# EAGLE design Shruthi-Analog-SMR4-mkII-12V-v03 (EAGLE 5.09)
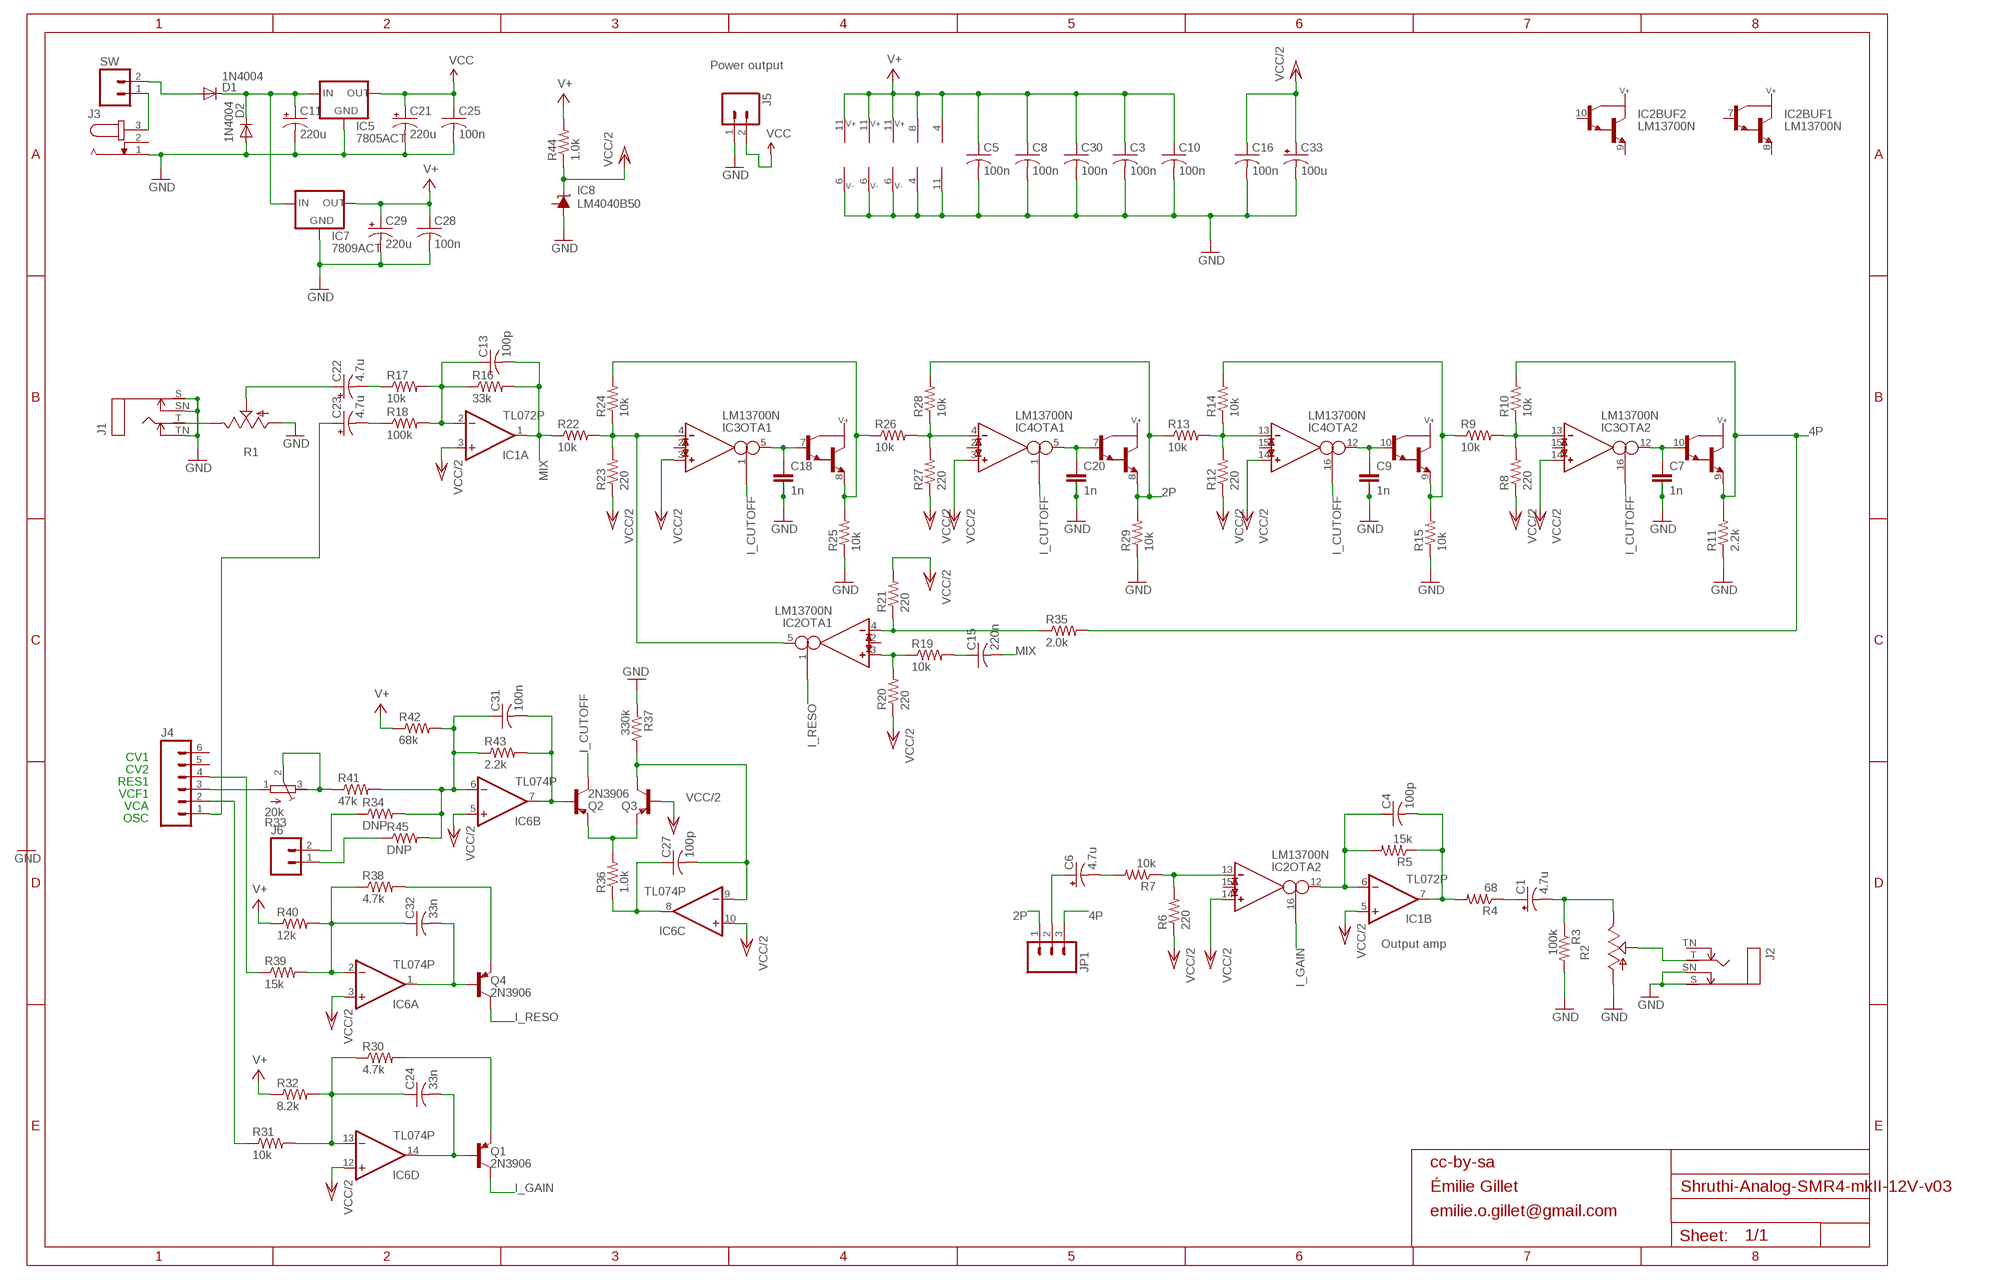
[diagram p0: schematic, sheet 1]

## Parts
C1  4.7u  CPOL-USE2.5-6  [E2,5-6]
C3  100n  C-US025-025X050  [C025-025X050]
C4  100p  C-US025-025X050  [C025-025X050]
C5  100n  C-US025-025X050  [C025-025X050]
C6  4.7u  CPOL-USE2.5-6  [E2,5-6]
C7  1n  C-2.5-5/2  [C2.5/5-2]
C8  100n  C-US025-025X050  [C025-025X050]
C9  1n  C-2.5-5/2  [C2.5/5-2]
C10  100n  C-US025-025X050  [C025-025X050]
C11  220u  CPOL-USE5-10.5  [E5-10,5]
C13  100p  C-US025-025X050  [C025-025X050]
C15  220n  C-US025-025X050  [C025-025X050]
C16  100n  C-US025-025X050  [C025-025X050]
C18  1n  C-2.5-5/2  [C2.5/5-2]
C20  1n  C-2.5-5/2  [C2.5/5-2]
C21  220u  CPOL-USE5-10.5  [E5-10,5]
C22  4.7u  CPOL-USE2.5-6  [E2,5-6]
C23  4.7u  CPOL-USE2.5-6  [E2,5-6]
C24  33n  C-US050-025X075  [C050-025X075]
C25  100n  C-US025-025X050  [C025-025X050]
C27  100p  C-US025-025X050  [C025-025X050]
C28  100n  C-US025-025X050  [C025-025X050]
C29  220u  CPOL-USE5-10.5  [E5-10,5]
C30  100n  C-US025-025X050  [C025-025X050]
C31  100n  C-US025-025X050  [C025-025X050]
C32  33n  C-US050-025X075  [C050-025X075]
C33  100u  CPOL-USE2.5-6  [E2,5-6]
D1  1N4004  [DO41-10]
D2  1N4004  [DO41-10]
IC1  TL072P  [DIL08]
IC2  LM13700N  [DIL16]
IC3  LM13700N  [DIL16]
IC4  LM13700N  [DIL16]
IC5  7805ACT  78XXS  [78XXS]
IC6  TL074P  TL084P  [DIL14]
IC7  7809ACT  78XXS  [78XXS]
IC8  LM4040B50  LM4041BILP  [LP_O-PBCY-W3]
J1  MONOSWS  [NMJ4HC-S]
J2  MONOSWS  [NMJ4HC-S]
J3  JACK-PLUG2  [SPC4078_BIG_HOLES]
J4  M06SIP  [1X06]
J5  M02PTH  [1X02]
J6  M02PTH  [1X02]
JP1  M03PTH  [1X03]
Q1  2N3906  2N3906-  [TO92-]
Q2  2N3906  2N3906-  [TO92-]
Q3  2N3906  2N3906-  [TO92-]
Q4  2N3906  2N3906-  [TO92-]
R1  POT_USCABLED  [CABLE_POT_6MM]
R2  POT_USCABLED  [CABLE_POT_6MM]
R3  100k  R-US_0204/7  [0204/7]
R4  68  R-US_0204/7  [0204/7]
R5  15k  R-US_0204/7  [0204/7]
R6  220  R-US_0204/7  [0204/7]
R7  10k  R-US_0204/7  [0204/7]
R8  220  R-US_0204/7  [0204/7]
R9  10k  R-US_0204/7  [0204/7]
R10  10k  R-US_0204/7  [0204/7]
R11  2.2k  R-US_0204/7  [0204/7]
R12  220  R-US_0204/7  [0204/7]
R13  10k  R-US_0204/7  [0204/7]
R14  10k  R-US_0204/7  [0204/7]
R15  10k  R-US_0204/7  [0204/7]
R16  33k  R-US_0204/7  [0204/7]
R17  10k  R-US_0204/7  [0204/7]
R18  100k  R-US_0204/7  [0204/7]
R19  10k  R-US_0204/7  [0204/7]
R20  220  R-US_0204/7  [0204/7]
R21  220  R-US_0204/7  [0204/7]
R22  10k  R-US_0204/7  [0204/7]
R23  220  R-US_0204/7  [0204/7]
R24  10k  R-US_0204/7  [0204/7]
R25  10k  R-US_0204/7  [0204/7]
R26  10k  R-US_0204/7  [0204/7]
R27  220  R-US_0204/7  [0204/7]
R28  10k  R-US_0204/7  [0204/7]
R29  10k  R-US_0204/7  [0204/7]
R30  4.7k  R-US_0204/7  [0204/7]
R31  10k  R-US_0204/7  [0204/7]
R32  8.2k  R-US_0204/7  [0204/7]
R33  20k  R-TRIMM3296W  [RTRIM3296W]
R34  DNP  R-US_0204/2V  [0204V]
R35  2.0k  R-US_0204/7  [0204/7]
R36  1.0k  R-US_0204/7  [0204/7]
R37  330k  R-US_0204/7  [0204/7]
R38  4.7k  R-US_0204/7  [0204/7]
R39  15k  R-US_0204/7  [0204/7]
R40  12k  R-US_0204/7  [0204/7]
R41  47k  R-US_0204/7  [0204/7]
R42  68k  R-US_0204/7  [0204/7]
R43  2.2k  R-US_0204/7  [0204/7]
R44  1.0k  R-US_0204/7  [0204/7]
R45  DNP  R-US_0204/2V  [0204V]
SW  M02PTH  [1X02]

## Nets
2P: IC4.8(BUF1:E) JP1.1 R13.1 R28.2 R29.2
4P: IC3.9(BUF2:E) JP1.3 R10.2 R11.2 R35.2
GND: C3.2 C5.2 C7.2 C7.3 C8.2 C9.2 C9.3 C10.2 C11.- C16.2 C18.2 C18.3 C20.2 C20.3 C21.- C25.2 C28.2 C29.- C30.2 C33.- D2.A IC1.4(P:V-) IC2.6(SUPPLY:V-) IC3.6(SUPPLY:V-) IC4.6(SUPPLY:V-) IC5.GND IC6.11(P:V-) IC7.GND IC8.3(A) J1.S J1.SN J1.TN J2.S J2.SN J3.1 J5.1 R1.A R2.A R3.2 R11.1 R15.1 R25.1 R29.1 R37.1
I_CUTOFF: IC3.1(OTA1:I_BIAS) IC3.16(OTA2:I_BIAS) IC4.1(OTA1:I_BIAS) IC4.16(OTA2:I_BIAS) Q2.1(C)
I_GAIN: IC2.16(OTA2:I_BIAS) Q1.1(C)
I_RESO: IC2.1(OTA1:I_BIAS) Q4.1(C)
MIX: C13.2 C15.2 IC1.1(A:OUT) R16.2 R22.1
N$1: D1.A SW.2
N$2: C31.2 IC6.7(B:OUT) Q2.2(B) R43.2
N$3: J3.3 SW.1
N$4: C11.+ D1.C D2.C IC5.IN IC7.IN
N$5: J4.3 R33.1(E)
N$6: C13.1 IC1.2(A:-IN) R16.1 R17.2 R18.2
N$7: Q2.3(E) Q3.3(E) R36.2
N$8: C6.+ JP1.2
N$9: C27.1 IC6.8(C:OUT) R36.1
N$10: C27.2 IC6.9(C:-IN) Q3.1(C) R37.2
N$11: J4.4 R39.1
N$12: IC2.5(OTA1:OUT) IC3.4(OTA1:IN_N) R22.2 R23.2 R24.1
N$13: J2.T R2.S
N$14: IC3.8(BUF1:E) R24.2 R25.2 R26.1
N$16: IC4.4(OTA1:IN_N) R26.2 R27.2 R28.1
N$17: C6.- R7.2
N$18: J6.2 R34.1
N$19: C20.1 IC4.5(OTA1:OUT) IC4.7(BUF1:B)
N$20: IC4.13(OTA2:IN_N) R12.2 R13.2 R14.1
N$21: C15.1 R19.2
N$22: J6.1 R45.1
N$23: C9.1 IC4.10(BUF2:B) IC4.12(OTA2:OUT)
N$24: IC3.13(OTA2:IN_N) R8.2 R9.2 R10.1
N$25: C1.+ R4.1
N$26: IC4.9(BUF2:E) R9.1 R14.2 R15.2
N$28: C7.1 IC3.10(BUF2:B) IC3.12(OTA2:OUT)
N$29: IC2.4(OTA1:IN_N) R21.1 R35.1
N$30: C32.2 IC6.1(A:OUT) Q4.2(B)
N$31: C24.2 IC6.14(D:OUT) Q1.2(B)
N$32: C1.- R2.E R3.1
N$33: IC2.3(OTA1:IN_P) R19.1 R20.2
N$34: IC2.13(OTA2:IN_N) R6.2 R7.1
N$35: C23.+ J4.1
N$38: J1.T R1.E
N$39: C23.- R18.1
N$40: C31.1 IC6.6(B:-IN) R34.2 R41.2 R42.2 R43.1 R45.2
N$41: R33.2(S) R33.3(A) R41.1
N$45: J4.2 R31.1
N$51: C24.1 IC6.13(D:-IN) R30.1 R31.2 R32.2
N$57: C32.1 IC6.2(A:-IN) R38.1 R39.2 R40.2
N$60: Q4.3(E) R38.2
N$63: C4.2 IC1.7(B:OUT) R4.2 R5.1
N$64: C18.1 IC3.5(OTA1:OUT) IC3.7(BUF1:B)
N$66: C22.+ R1.S
N$68: Q1.3(E) R30.2
N$70: C4.1 IC1.6(B:-IN) IC2.12(OTA2:OUT) R5.2
N$72: C22.- R17.1
V+: C3.1 C5.1 C8.1 C10.1 C28.1 C29.+ C30.1 IC1.8(P:V+) IC2.11(SUPPLY:V+) IC3.11(SUPPLY:V+) IC4.11(SUPPLY:V+) IC6.4(P:V+) IC7.OUT R32.1 R40.1 R42.1 R44.2
VCC: C21.+ C25.1 IC5.OUT J5.2
VCC/2: C16.1 C33.+ IC1.3(A:+IN) IC1.5(B:+IN) IC2.14(OTA2:IN_P) IC3.3(OTA1:IN_P) IC3.14(OTA2:IN_P) IC4.3(OTA1:IN_P) IC4.14(OTA2:IN_P) IC6.3(A:+IN) IC6.5(B:+IN) IC6.10(C:+IN) IC6.12(D:+IN) IC8.2(C) Q3.2(B) R6.1 R8.1 R12.1 R20.1 R21.2 R23.1 R27.1 R44.1
Unconnected: IC2.2(OTA1:I_DIODE) IC2.7(BUF1:B) IC2.8(BUF1:E) IC2.9(BUF2:E) IC2.10(BUF2:B) IC2.15(OTA2:I_DIODE) IC3.2(OTA1:I_DIODE) IC3.15(OTA2:I_DIODE) IC4.2(OTA1:I_DIODE) IC4.15(OTA2:I_DIODE) IC8.1(FB) J2.TN J3.2 J4.5 J4.6

## Notes on the sheet
- Power output
- CV1
- CV2
- RES1
- VCF1
- VCA
- OSC
- Output amp
- cc-by-sa
- Émilie Gillet
- emilie.o.gillet@gmail.com

## Library data of the parts
C1 C6 C11 C21-C23 C29 C33 = rcl:CPOL-US: POLARIZED CAPACITOR, American symbol
C3-C5 C8 C10 C13 C15 C16 C24 C25 C27 C28 C30-C32 = rcl:C-US: CAPACITOR, American symbol
C7 C9 C18 C20 = capacitor-wima:C-: CAPACITOR for alternative placement naming: default grid - extended grid/package width
D1 D2 = diode:1N4004: DIODE general purpose rectifier, 1 A
IC1 = gm-ics:TL072: OP AMP
IC2-IC4 = ota:LM13700: Dual OTA with buffers
IC5 IC7 = v-reg:78XXS: VOLTAGE REGULATOR
IC6 = linear:TL084: OP AMP
IC8 = texas:LM4041*I: PRECISION MICROPOWER SHUNT VOLTAGE REFERENCE Adjustable Output Source: http://focus.ti.com/lit/ds/slcs146e/slcs146e.pdf
J1 J2 = gm-jacks:MONOSW
J3 = con-jack2:JACK-PLUG: DC POWER JACK Power Jack, DC, Right Angle, Through Hole, Rated 5A at 16VDC, PC Terminals Distributor: Farnell (www.Farnell.de) Drawing: 84N1161.pdf / 84N1162.pdf Manufacturer: SPC Technology (www.spctechnology.com) Type: SPC4077 / SPC 4078
J4 = SparkFun:M06: Header 6 Standard 6-pin 0.1" header. Use with straight break away headers (SKU : PRT-00116), right angle break away headers (PRT-00553), swiss pins (PRT-00743), machine pins (PRT-00117), and female headers (PRT-00115). Molex polarized connector foot print use with SKU : PRT-08094 with associated crimp pins and housings. NOTES ON THE VARIANTS LOCK and LOCK_LONGPADS... This footprint was designed to help hold the alignment of a through-hole component (i.e. 6-pin header) while soldering it into place. You may notice that each hole has been shifted either up or down by 0.005 of an inch from it's more standard position (which is a perfectly straight line). This slight alteration caused the pins (the squares in the middle) to touch the edges of the holes. Because they are alternating, it causes a "brace" to hold the component in place. 0.005 has proven to be the perfect amount of "off-center" position when using our standard breakaway headers. Although looks a little odd when you look at the bare footprint, once you have a header in there, the alteration is very hard to notice. Also, if you push a header all the way into place, it is covered up entirely on the bottom side. This idea of altering the position of holes to aid alignment will be further integrated into the Sparkfun Library for other footprints. It can help hold any component with 3 or more connection pins.
J5 J6 SW = SparkFun:M02: Header 2 Standard 2-pin 0.1" header. Use with straight break away headers (SKU : PRT-00116), right angle break away headers (PRT-00553), swiss pins (PRT-00743), machine pins (PRT-00117), and female headers (PRT-00115). Molex polarized connector foot print use with SKU : PRT-08233 with associated crimp pins and housings.
JP1 = SparkFun:M03: Header 3 Standard 3-pin 0.1" header. Use with straight break away headers (SKU : PRT-00116), right angle break away headers (PRT-00553), swiss pins (PRT-00743), machine pins (PRT-00117), and female headers (PRT-00115). Molex polarized connector foot print use with SKU : PRT-08232 with associated crimp pins and housings.
Q1-Q4 = gm-trans:2N3906: PNP Transistor
R1 R2 = pot-alps:POT_US
R3-R32 R34-R45 = rcl:R-US_: RESISTOR, American symbol
R33 = rcl:R-TRIMM: Trimm resistor

## Board
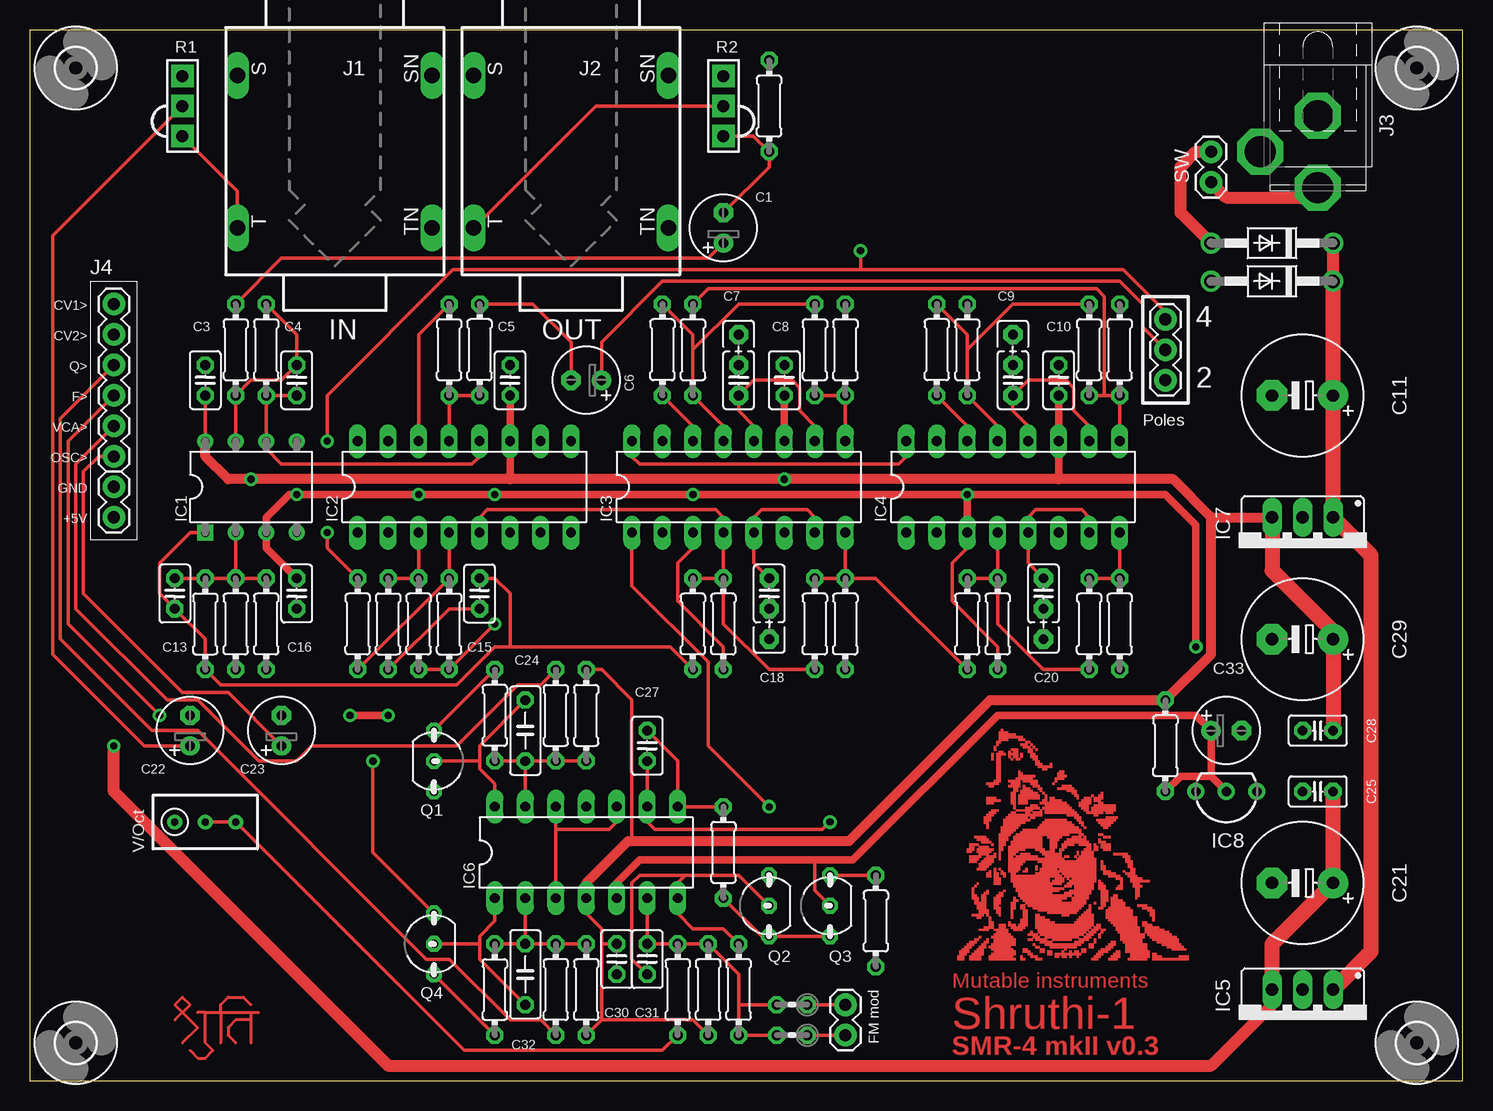
[diagram p1: board, top side]
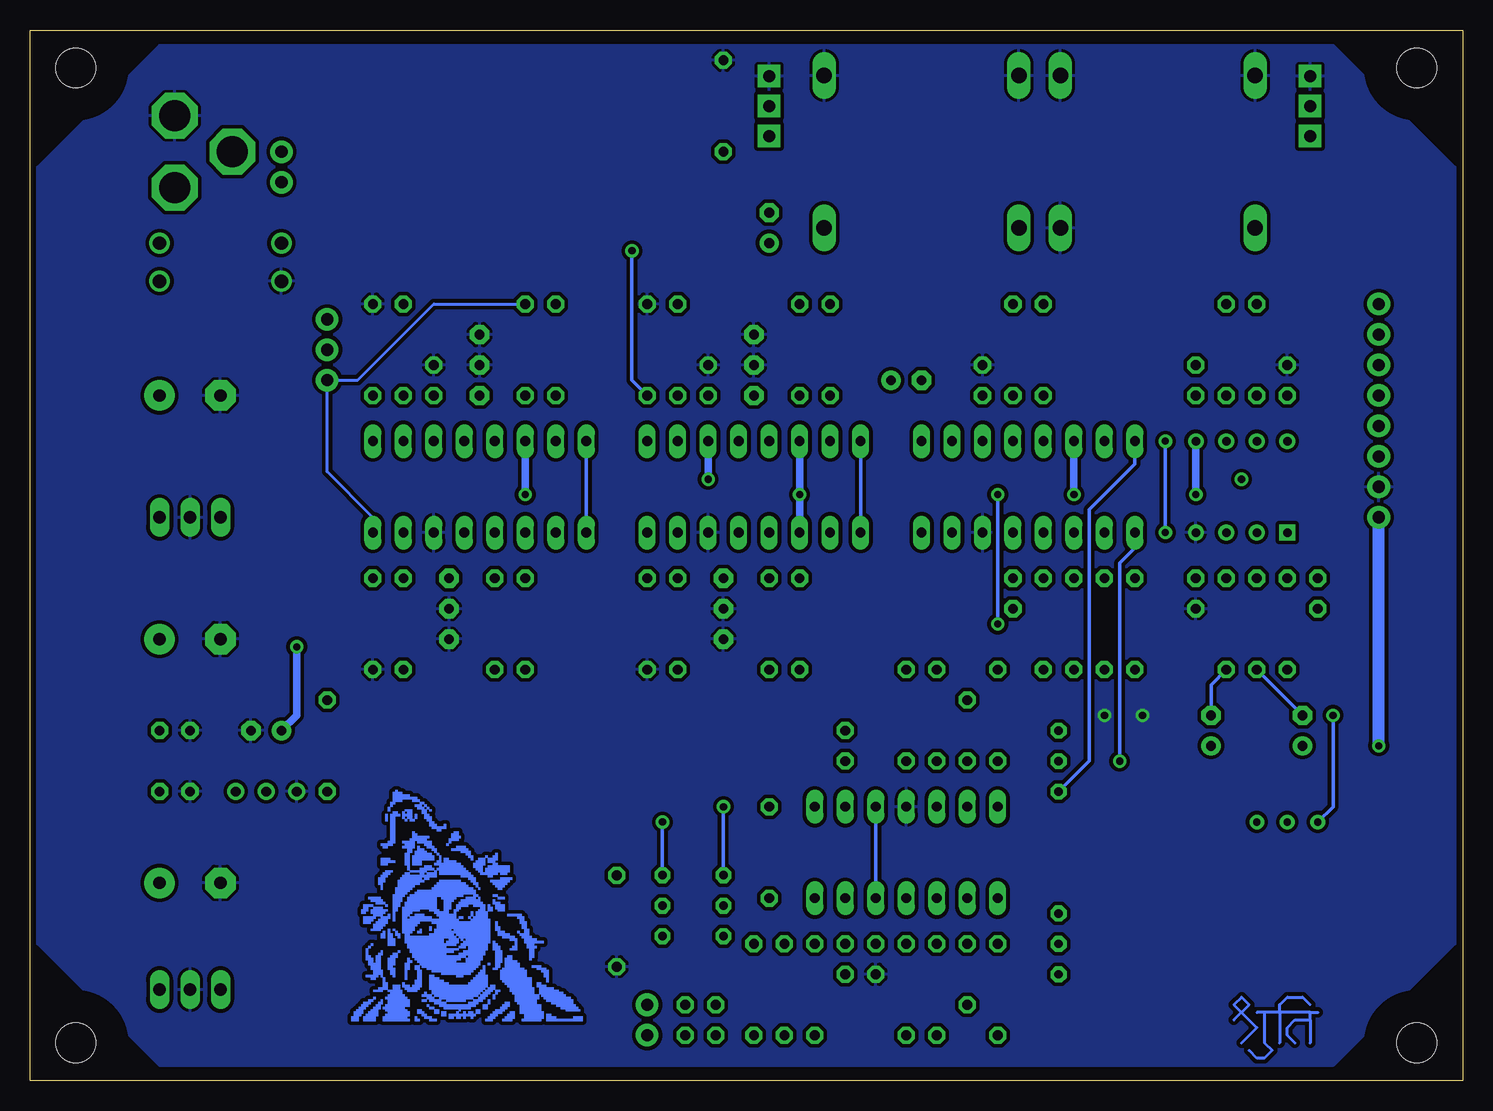
[diagram p2: board, bottom side, seen from below]

Size 119.38 x 87.62 mm. Coordinates in mm from the lower left corner, seen from the top.
Outline: 0,0 119.38,0 119.38,87.62 0,87.62 0,0
Copper layers (1*16): Top 0.035mm / dielectric 1.5mm / Bottom 0.035mm
Design rules "SparkFun_10mil *": minimum track width 8mil, minimum drill 20mil, track to track 8mil, track to pad 8mil, pad to pad 8mil, via to via 8mil, smd to smd 8mil, copper to edge 8mil, drill to drill 8mil, minimum pad ring 12mil, minimum via ring 10mil, stop-mask expansion 4mil, vias tented up to drill 25mil, thermal gap 10mil

### Footprints (pad centres in the part's own frame; a part is rotated, then mirrored left to right if it is on the bottom)
E2,5-6 = drill 0.813 pad 1.6 round: + -1.27,0 | drill 0.813 pad 1.6 octagon: - 1.27,0
C025-025X050 = drill 0.813 octagon: 1 -1.27,0; 2 1.27,0
C2.5/5-2 = drill 0.813 pad 1.6 octagon: 1 -1.27,0; 2 1.27,0; 3 3.81,0
E5-10,5 = drill 1.016 pad 2.54 round: + -2.54,0 | drill 1.016 pad 2.54 octagon: - 2.54,0
C050-025X075 = drill 0.813 octagon: 1 -2.54,0; 2 2.54,0
DO41-10 = drill 1.118 round: A 5.08,0; C -5.08,0
DIL08 = drill 0.7 square: 1 -3.81,-3.81 | drill 0.7 round: 2 -1.27,-3.81; 3 1.27,-3.81; 4 3.81,-3.81; 5 3.81,3.81; 6 1.27,3.81; 7 -1.27,3.81; 8 -3.81,3.81
DIL16 = drill 0.813 long: 1 -8.89,-3.81; 2 -6.35,-3.81; 3 -3.81,-3.81; 4 -1.27,-3.81; 5 1.27,-3.81; 6 3.81,-3.81; 7 6.35,-3.81; 8 8.89,-3.81; 9 8.89,3.81; 10 6.35,3.81; 11 3.81,3.81; 12 1.27,3.81; 13 -1.27,3.81; 14 -3.81,3.81; 15 -6.35,3.81; 16 -8.89,3.81
78XXS = drill 1.016 long: GND 0,-2.54; IN -2.54,-2.54; OUT 2.54,-2.54
DIL14 = drill 0.813 long: 1 -7.62,-3.81; 2 -5.08,-3.81; 3 -2.54,-3.81; 4 0,-3.81; 5 2.54,-3.81; 6 5.08,-3.81; 7 7.62,-3.81; 8 7.62,3.81; 9 5.08,3.81; 10 2.54,3.81; 11 0,3.81; 12 -2.54,3.81; 13 -5.08,3.81; 14 -7.62,3.81
LP_O-PBCY-W3 = drill 0.8 pad 1.4 round: 1 -2.54,0; 2 0,0; 3 2.54,0
NMJ4HC-S = drill 1.3 long: S 5.08,8.115; SN 5.08,-8.115; T -7.62,8.115; TN -7.62,-8.115
SPC4078_BIG_HOLES = drill 2.6 pad 3.81 octagon: 1 -0.46,0; 2 2.54,-4.8; 3 5.54,0
1X06 = drill 1.016 pad 1.88 round: 1 0,0; 2 2.54,0; 3 5.08,0; 4 7.62,0; 5 10.16,0; 6 12.7,0
1X02 = drill 1.016 pad 1.88 round: 1 0,0; 2 2.54,0
1X03 = drill 1.016 pad 1.88 round: 1 0,0; 2 2.54,0; 3 5.08,0
TO92- = drill 0.7 octagon: 1 2.54,0; 2 0,0; 3 -2.54,0
CABLE_POT_6MM = drill 1 pad 1.88 square: A -2.5,0; E 2.5,0; S 0,0
0204/7 = drill 0.813 octagon: 1 -3.81,0; 2 3.81,0
RTRIM3296W = drill 0.61 round: 1 0,-2.54; 2 0,0; 3 0,2.54
0204V = drill 0.813 octagon: 1 -1.27,0; 2 1.27,0
3,3 = hole 3.3: 0,0

### Placement (x,y rotation side)
C1  57.78,71.12 90 top
C3  14.61,58.42 90 top
C4  22.23,58.42 90 top
C5  40.01,58.42 90 top
C6  46.35,58.42 180 top
C7  59.05,58.42 90 top
C8  62.87,58.42 90 top
C9  81.92,58.42 90 top
C10  85.72,58.42 90 top
C11  106.05,57.15 180 top
C13  12.07,40.64 270 top
C15  37.47,40.64 90 top
C16  22.23,40.64 270 top
C18  61.59,40.64 270 top
C20  84.45,40.64 270 top
C21  106.05,16.51 180 top
C22  13.34,29.21 90 top
C23  20.96,29.21 90 top
C24  41.27,29.21 90 top
C25  107.31,24.13 180 top
C27  51.44,27.94 270 top
C28  107.31,29.21 180 top
C29  106.05,36.83 180 top
C30  48.89,10.16 270 top
C31  51.44,10.16 270 top
C32  41.27,8.89 270 top
C33  99.69,29.21 0 top
D1  103.5,69.85 180 top
D2  103.5,66.67 180 top
IC1  18.41,49.53 0 top
IC2  36.2,49.53 0 top
IC3  59.05,49.53 0 top
IC4  81.92,49.53 0 top
IC5  106.05,5.08 180 top
IC6  46.35,19.05 0 top
IC7  106.05,44.45 180 top
IC8  99.69,24.13 180 top
J1  25.4,78.74 90 top
J2  45.09,78.74 90 top
J3  107.31,80.01 270 top
J4  6.99,52.07 90 top
J5  6.99,49.53 270 top
J6  67.95,3.81 90 top
JP1  94.61,58.42 90 top
Q1  33.66,26.67 270 top
Q2  61.59,14.61 90 top
Q3  66.67,14.61 90 top
Q4  33.66,11.43 90 top
R1  12.7,81.28 270 top
R2  57.78,81.28 270 top
R3  61.59,81.28 90 top
R4  17.14,60.96 270 top
R5  19.68,60.96 270 top
R6  34.93,60.96 270 top
R7  37.47,60.96 90 top
R8  52.7,60.96 90 top
R9  55.24,60.96 270 top
R10  65.41,60.96 270 top
R11  67.95,60.96 270 top
R12  75.56,60.96 90 top
R13  78.11,60.96 270 top
R14  88.27,60.96 270 top
R15  90.8,60.96 270 top
R16  14.61,38.1 270 top
R17  17.14,38.1 90 top
R18  19.68,38.1 90 top
R19  29.84,38.1 270 top
R20  32.38,38.1 90 top
R21  34.93,38.1 270 top
R22  55.24,38.1 90 top
R23  57.78,38.1 90 top
R24  65.41,38.1 90 top
R25  67.95,38.1 90 top
R26  78.11,38.1 90 top
R27  80.64,38.1 90 top
R28  88.27,38.1 90 top
R29  90.8,38.1 90 top
R30  38.73,30.48 90 top
R31  43.81,30.48 270 top
R32  46.35,30.48 270 top
R33  14.61,21.59 270 top
R34  63.5,6.35 180 top
R35  27.3,38.1 90 top
R36  57.78,19.05 270 top
R37  70.48,13.34 90 top
R38  38.73,7.62 270 top
R39  43.81,7.62 90 top
R40  46.35,7.62 90 top
R41  53.98,7.62 90 top
R42  56.52,7.62 90 top
R43  59.05,7.62 90 top
R44  94.61,27.94 90 top
R45  63.5,3.81 180 top
SW  98.42,74.93 90 top
U$1  [3,3]  3.81,84.45 0 top
U$2  [3,3]  115.57,84.45 0 top
U$3  [SARASWATI_COPPER]  77.15,10.16 0 top
U$4  [3,3]  3.81,3.17 0 top
U$5  [3,3]  115.57,3.17 0 top
U$100  [SARASWATI_COPPER]  92.71,5.08 0 bottom

### Tracks (layer width: path | path; a pad name or v marks a point on that pad's centre or on a via)
2P
  Top 0.305: R28.2 R29.2 IC4.8
  Bottom 0.254: R13.1 85.72,64.77 92.08,58.42 JP1.1 94.61,50.8 90.8,46.99 IC4.8
4P  (via drill 0.6)
  Top 0.305: JP1.3 94.61,64.14 91.12,67.63 69.22,67.63 | v24.77,53.34 24.77,57.15 35.24,67.63 69.22,67.63 | 69.22,67.63 v69.22,69.22 | IC3.9 R11.2 R10.2 | R35.2 24.77,44.45 v24.77,45.72
  Bottom 0.305: v69.22,69.22 69.22,58.42 R11.2 | v24.77,45.72 v24.77,53.34
GND  (via drill 0.6)
  Top 0.61: v26.67,30.48 v29.84,30.48
  pour Bottom (isolate 0.305): 118.75,76.2 108.58,86.36 10.79,86.36 0.64,76.2 0.64,11.43 10.79,1.27 108.58,1.27 118.75,11.43
I_CUTOFF  (via drill 0.6)
  Top 0.305: IC3.16 50.16,52.07 50.8,51.44 72.39,51.44 73.03,52.07 IC4.16 | v61.59,22.86 56.52,27.94 56.52,34.92 50.16,41.28 IC3.1
  Bottom 0.305: IC4.16 IC4.1 | IC3.1 IC3.16 | Q2.1 v61.59,22.86
I_GAIN
  Bottom 0.305: Q1.1 31.11,26.67 31.11,47.62 27.3,51.44 IC2.16
I_RESO  (via drill 0.6)
  Top 0.305: v28.57,26.67 28.57,19.05 Q4.1
  Bottom 0.305: v28.57,26.67 28.57,43.18 27.3,44.45 IC2.1
MIX
  Top 0.305: IC1.1 13.34,45.72 10.79,43.18 10.79,40.64 C13.2 14.61,36.83 R16.2 15.88,33.02 35.56,33.02 38.73,36.2 40.01,36.2 | 40.01,36.2 53.34,36.2 R22.1 | C15.2 38.73,41.91 40.01,40.64 40.01,36.2
N$1
  Top 1.016: SW.2 97.16,77.47 95.89,76.2 95.89,72.39 D1.A
N$2
  Top 0.305: R43.2 57.78,12.7 55.24,12.7 53.98,13.97 IC6.7 53.98,16.51 54.61,17.14 | C31.2 50.16,10.16 50.16,16.51 50.8,17.14 54.61,17.14 | Q2.2 59.05,17.14 54.61,17.14
N$3
  Top 1.016: J3.3 106.5,73.66 99.69,73.66 SW.1
N$4
  Top 1.016: D2.C D1.C
  Top 1.27: D2.C C11.+ IC7.IN 111.76,43.82 111.76,10.79 IC5.IN
N$5  (via drill 0.6)
  Top 0.305: J4.3 3.18,53.34 3.18,38.1 v10.79,30.48
  Bottom 0.305: R33.1 10.79,22.86 v10.79,30.48
N$6
  Top 0.305: R17.2 IC1.2 | R17.2 R16.1 C13.1 | R17.2 R18.2
N$7
  Top 0.305: Q3.3 Q2.3 60.96,12.07 R36.2
N$8
  Top 0.305: JP1.2 92.71,62.87 92.71,64.77 90.8,66.67 52.7,66.67 47.62,61.59 C6.+
N$9
  Top 0.305: R36.1 IC6.8 53.98,26.67 C27.1
N$10  (via drill 0.6)
  Top 0.305: C27.2 IC6.9 51.44,21.59 52.07,20.95 66.04,20.95 v66.67,21.59 | Q3.1 R37.2
  Bottom 0.305: v66.67,21.59 Q3.1
N$11
  Top 0.305: J4.4 2.54,55.25 2.54,36.83 10.16,29.21 13.97,29.21 33.02,10.16 34.93,10.16 40.01,5.08 42.55,5.08 R39.1
N$12
  Top 0.305: R23.2 IC3.4 57.78,46.99 57.15,47.62 38.1,47.62 37.47,46.99 IC2.5 | R23.2 R22.2 | R23.2 57.78,38.1 61.59,34.29 R24.1
N$13
  Top 0.305: J2.T 47.13,81.28 R2.S
N$14
  Top 0.305: R25.2 IC3.8 | R26.1 70.48,41.91 R25.2 | R25.2 R24.2
N$15
  Bottom 0.254: 18.41,3.17 17.14,4.45 19.05,6.35 18.41,6.98 17.78,6.35 19.05,5.08
N$16
  Top 0.305: R28.1 84.45,34.29 80.64,38.1 R27.2 | R27.2 IC4.4 | R27.2 R26.2
N$17
  Top 0.305: R7.2 41.91,64.77 45.09,61.59 C6.-
N$18
  Top 0.305: R34.1 J6.2
N$19
  Top 0.305: IC4.7 88.27,46.99 87.63,47.62 83.82,47.62 83.19,46.99 IC4.5 83.19,43.18 C20.1
N$20
  Top 0.305: R14.1 81.92,64.77 78.11,60.96 | IC4.13 80.64,54.61 R13.2 78.11,60.96 | R12.2 78.11,62.23 78.11,60.96
N$21
  Top 0.305: C15.1 34.93,39.37 R19.2
N$22
  Top 0.305: R45.1 J6.1
N$23
  Top 0.305: IC4.10 88.27,54.61 87,55.88 87,57.79 86.36,58.42 83.19,58.42 C9.1 81.92,55.88 83.19,54.61 IC4.12
N$24
  Top 0.305: IC3.13 57.78,54.61 R9.2 55.24,60.96 | R10.1 59.05,64.77 55.24,60.96 | R8.2 55.24,62.23 55.24,60.96
N$25
  Top 0.305: C1.+ 56.52,68.58 20.96,68.58 R4.1
N$26
  Top 0.305: IC4.9 R15.2 89.53,57.15 | 89.53,57.15 R14.2 | R9.1 56.52,66.04 88.9,66.04 89.53,65.41 89.53,57.15
N$28
  Top 0.305: 60.33,52.07 IC3.12 60.33,54.61 59.05,55.88 C7.1 60.33,58.42 63.5,58.42 64.14,57.79 64.14,55.88 65.41,54.61 IC3.10
N$29
  Top 0.305: IC2.4 R21.1 R35.1
N$30
  Top 0.305: IC6.1 38.73,13.34 37.47,12.07 37.47,11.43 | 37.47,11.43 37.47,10.16 C32.2 | Q4.2 37.47,11.43
N$31
  Top 0.305: IC6.14 38.73,24.76 37.47,26.04 37.47,26.67 | 37.47,26.67 37.47,27.94 C24.2 | 37.47,26.67 Q1.2
N$32
  Top 0.305: C1.- 61.59,76.2 R3.1 60.28,78.78 R2.E
N$33
  Top 0.305: R19.1 R20.2 IC2.3
N$34
  Top 0.305: R7.1 R6.2 IC2.13
N$35
  Top 0.305: J4.1 5.71,52.07 4.45,50.8 4.45,40.64 12.7,32.38 16.51,32.38 C23.+
N$38
  Top 0.305: R1.E 17.29,74.2 J1.T
N$39
  Bottom 0.305: C23.- 20.96,33.02 R18.1
N$40
  Top 0.305: IC6.6 C31.1 R41.2 R42.2 59.05,8.89 59.05,6.35 | 59.05,6.35 R43.1 R45.2 | 59.05,6.35 R34.2
N$41
  Top 0.305: R33.2 R33.3 36.2,2.54 52.7,2.54 R41.1
N$45
  Top 0.305: J4.2 3.81,51.44 3.81,39.37 11.43,31.75 13.97,31.75 19.05,26.67 22.23,26.67 23.5,27.94 35.56,27.94 40.64,33.02 42.55,33.02 R31.1
N$51
  Top 0.305: C24.1 R30.1 | R32.2 R31.2 C24.1 | IC6.13 C24.1
N$52
  Bottom 0.254: 16.51,5.71 17.14,5.71 | 15.24,5.71 16.51,5.71 | 12.7,5.71 15.24,5.71 | 12.7,5.71 12.07,5.71 | 12.7,5.08 12.7,3.17 | 12.7,5.08 12.7,5.71 | 12.7,5.08 13.97,5.08 14.61,4.45 14.61,3.81 13.97,3.17 | 16.51,5.71 16.51,3.17 15.88,2.54 16.51,1.91 17.14,1.91 17.78,2.54 | 15.24,5.71 15.24,3.17 | 15.24,5.71 15.24,6.35 14.61,6.98 13.34,6.98 12.7,6.35
N$53
  Top 0.254: 12.7,3.17 13.97,4.45 12.07,6.35 12.7,6.98 13.34,6.35 12.07,5.08
N$54
  Top 0.254: 14.61,5.71 13.97,5.71 | 14.61,5.71 15.88,5.71 | 15.88,5.71 18.41,5.71 | 18.41,5.71 19.05,5.71 | 18.41,5.08 18.41,3.17 | 18.41,5.71 18.41,5.08 | 18.41,5.08 17.14,5.08 16.51,4.45 16.51,3.81 17.14,3.17 | 14.61,5.71 14.61,3.17 15.24,2.54 14.61,1.91 13.97,1.91 13.34,2.54 | 15.88,5.71 15.88,3.17 | 15.88,5.71 15.88,6.35 16.51,6.98 17.78,6.98 18.41,6.35
N$57
  Top 0.305: R40.2 R39.2 C32.1 | R38.1 C32.1 | C32.1 IC6.2
N$60
  Top 0.305: Q4.3 R38.2
N$63
  Top 0.305: IC1.7 R4.2 18.41,58.42 20.96,58.42 C4.2 22.23,62.23 R5.1
N$64
  Top 0.305: IC3.7 65.41,46.99 64.77,47.62 60.96,47.62 60.33,46.99 IC3.5 60.33,43.18 C18.1
N$66
  Top 0.305: C22.+ 9.53,27.94 1.91,35.56 1.91,70.48 R1.S
N$68
  Top 0.305: Q1.3 R30.2
N$70
  Top 0.305: IC2.12 37.47,52.07 36.83,51.44 20.96,51.44 19.68,52.71 IC1.6 R5.2 C4.1
N$72
  Bottom 0.305: C22.- R17.1
V+  (via drill 0.6)
  Top 0.305: IC1.8 C3.1 | IC6.4 46.35,13.97 47.62,12.7 47.62,11.43 | 47.62,5.08 47.62,11.43 | R40.1 47.62,5.08 | 47.62,11.43 C30.1 | R32.1 47.62,34.29 50.16,31.75 50.16,20 | R42.1 55.24,5.08 47.62,5.08
  Top 0.61: 40.01,50.16 IC2.11 C5.1 | 85.72,50.16 IC4.11 C10.1 | IC3.11 C8.1
  Top 0.813: IC1.8 14.61,52.07 16.51,50.16 v18.41,50.16 40.01,50.16 v62.87,50.16 85.72,50.16 95.25,50.16 98.42,46.99 | IC6.4 46.35,16.51 49.85,20 50.16,20 68.26,20 80.01,31.75 R44.2 98.42,35.56 98.42,46.99 | 98.42,46.99 IC7.OUT
  Top 1.27: IC7.OUT 103.5,42.55 108.58,37.47 C29.+ C28.1
  Bottom 0.61: v62.87,50.16 IC3.11
VCC  (via drill 0.6)
  Top 1.016: 103.5,8.26 103.5,6.35 98.42,1.27 29.84,1.27 6.99,24.13 v6.99,27.94
  Top 1.27: IC5.OUT 103.5,8.26 103.5,11.43 C21.+ C25.1
  Bottom 1.016: v6.99,27.94 J5.2
VCC/2  (via drill 0.6)
  Top 0.305: IC2.14 32.38,62.23 R6.1 | IC4.3 78.11,44.45 76.83,43.18 76.83,40.01 80.64,36.2 R27.1 | R20.1 R21.2 v38.73,38.1 | IC6.3 43.81,20.95 | 43.81,20.95 IC6.12 | IC3.3 55.24,44.45 53.98,43.18 53.98,40.01 57.78,36.2 R23.1 | IC6.10 48.89,21.59 48.26,20.95 43.81,20.95 | Q3.2 65.41,15.88 65.41,18.41 | R8.1 55.24,54.61 IC3.14 | R12.1 78.11,54.61 IC4.14
  Top 0.61: v78.11,48.9 v55.24,48.9 v38.73,48.9 v32.38,48.9 v22.23,48.9 21.59,48.9 19.68,46.99 IC1.3 19.68,44.45 C16.1 | v78.11,48.9 94.61,48.9 97.16,46.36 v97.16,36.2 | v78.11,48.9 IC4.3 | IC6.5 48.89,16.51 50.8,18.41 65.41,18.41 68.58,18.41 80.64,30.48 97.16,30.48 C33.+ 98.42,25.4 | R44.1 95.89,25.4 98.42,25.4 | 98.42,25.4 IC8.2
  Bottom 0.305: IC6.10 IC6.5 | v38.73,48.9 v38.73,38.1
  Bottom 0.61: v22.23,48.9 IC1.5 | IC3.14 v55.24,48.9 IC3.3 | v32.38,48.9 IC2.14 | v78.11,48.9 IC4.14 | C33.+ 97.16,30.48 v97.16,36.2

### Text on the board
Top: Mutable instruments | Shruthi-1 | SMR-4 mkII v0.3
tPlace: CV1> | CV2> | 4 | Q> | F> | 2 | VCA> | Poles | OSC> | GND | +5V | V/Oct
tNames: IN | OUT | FM mod
tStop: Mutable instruments | Shruthi-1 | SMR-4 mkII v0.2